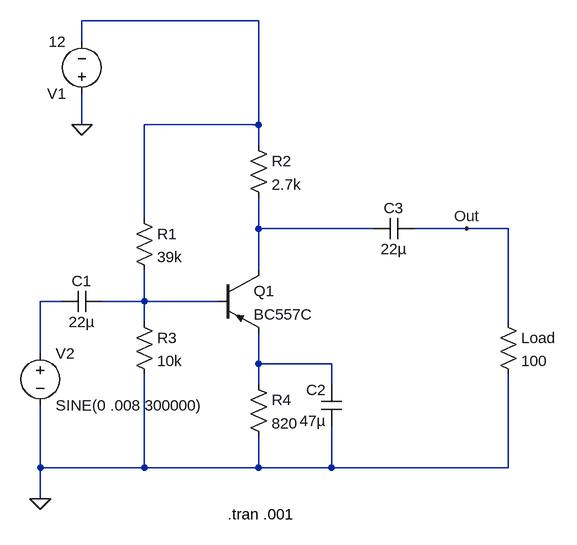
[diagram p0: schematic 11-AmpliEmeteurCommun.asc]
11-AmpliEmeteurCommun.asc, the LTspice schematic file:
Version 4
SHEET 1 880 680
WIRE 208 -288 -64 -288
WIRE -64 -256 -64 -288
WIRE -64 -128 -64 -176
WIRE 208 -128 208 -288
WIRE 208 -128 32 -128
WIRE 208 -96 208 -128
WIRE 32 16 32 -128
WIRE 208 32 208 -16
WIRE 384 32 208 32
WIRE 528 32 448 32
WIRE 592 32 528 32
WIRE 208 96 208 32
WIRE -96 144 -128 144
WIRE 32 144 32 96
WIRE 32 144 -32 144
WIRE 144 144 32 144
WIRE 32 176 32 144
WIRE 592 176 592 32
WIRE -128 224 -128 144
WIRE 208 240 208 192
WIRE 320 240 208 240
WIRE 208 272 208 240
WIRE 320 272 320 240
WIRE -128 400 -128 304
WIRE 32 400 32 256
WIRE 32 400 -128 400
WIRE 208 400 208 352
WIRE 208 400 32 400
WIRE 320 400 320 336
WIRE 320 400 208 400
WIRE 592 400 592 256
WIRE 592 400 320 400
WIRE -128 448 -128 400
FLAG -64 -128 0
FLAG -128 448 0
FLAG 528 32 Out
SYMBOL pnp 144 96 R0
SYMATTR InstName Q1
SYMATTR Value BC557C
SYMBOL voltage -64 -160 R180
WINDOW 123 0 0 Left 0
WINDOW 39 0 0 Left 0
SYMATTR InstName V1
SYMATTR Value 12
SYMBOL voltage -128 208 R0
WINDOW 123 0 0 Left 0
WINDOW 39 0 0 Left 0
SYMATTR InstName V2
SYMATTR Value SINE(0 .008 300000)
SYMBOL cap -32 128 R90
WINDOW 0 0 32 VBottom 2
WINDOW 3 32 32 VTop 2
SYMATTR InstName C1
SYMATTR Value 22µ
SYMBOL cap 336 336 R180
WINDOW 0 24 56 Left 2
WINDOW 3 24 8 Left 2
SYMATTR InstName C2
SYMATTR Value 47µ
SYMBOL cap 384 48 R270
WINDOW 0 32 32 VTop 2
WINDOW 3 0 32 VBottom 2
SYMATTR InstName C3
SYMATTR Value 22µ
SYMBOL res 16 0 R0
SYMATTR InstName R1
SYMATTR Value 39k
SYMBOL res 192 -112 R0
SYMATTR InstName R2
SYMATTR Value 2.7k
SYMBOL res 16 160 R0
SYMATTR InstName R3
SYMATTR Value 10k
SYMBOL res 192 256 R0
SYMATTR InstName R4
SYMATTR Value 820
SYMBOL res 576 160 R0
SYMATTR InstName Load
SYMATTR Value 100
TEXT 160 472 Left 2 !.tran .001

The netlist it stands for:
* 11-AmpliEmeteurCommun.asc
Q1 N002 N004 N005 0 BC557C
V1 0 N001 12
V2 N003 0 SINE(0 .008 300000)
C1 N004 N003 22µ
C2 0 N005 47µ
C3 N002 Out 22µ
R1 N001 N004 39k
R2 N001 N002 2.7k
R3 N004 0 10k
R4 N005 0 820
R§Load Out 0 100
.model NPN NPN
.model PNP PNP
.lib standard.bjt
.tran .001
.backanno
.end